# EAGLE design App_Board_V1.2 (EAGLE 7.1.0)
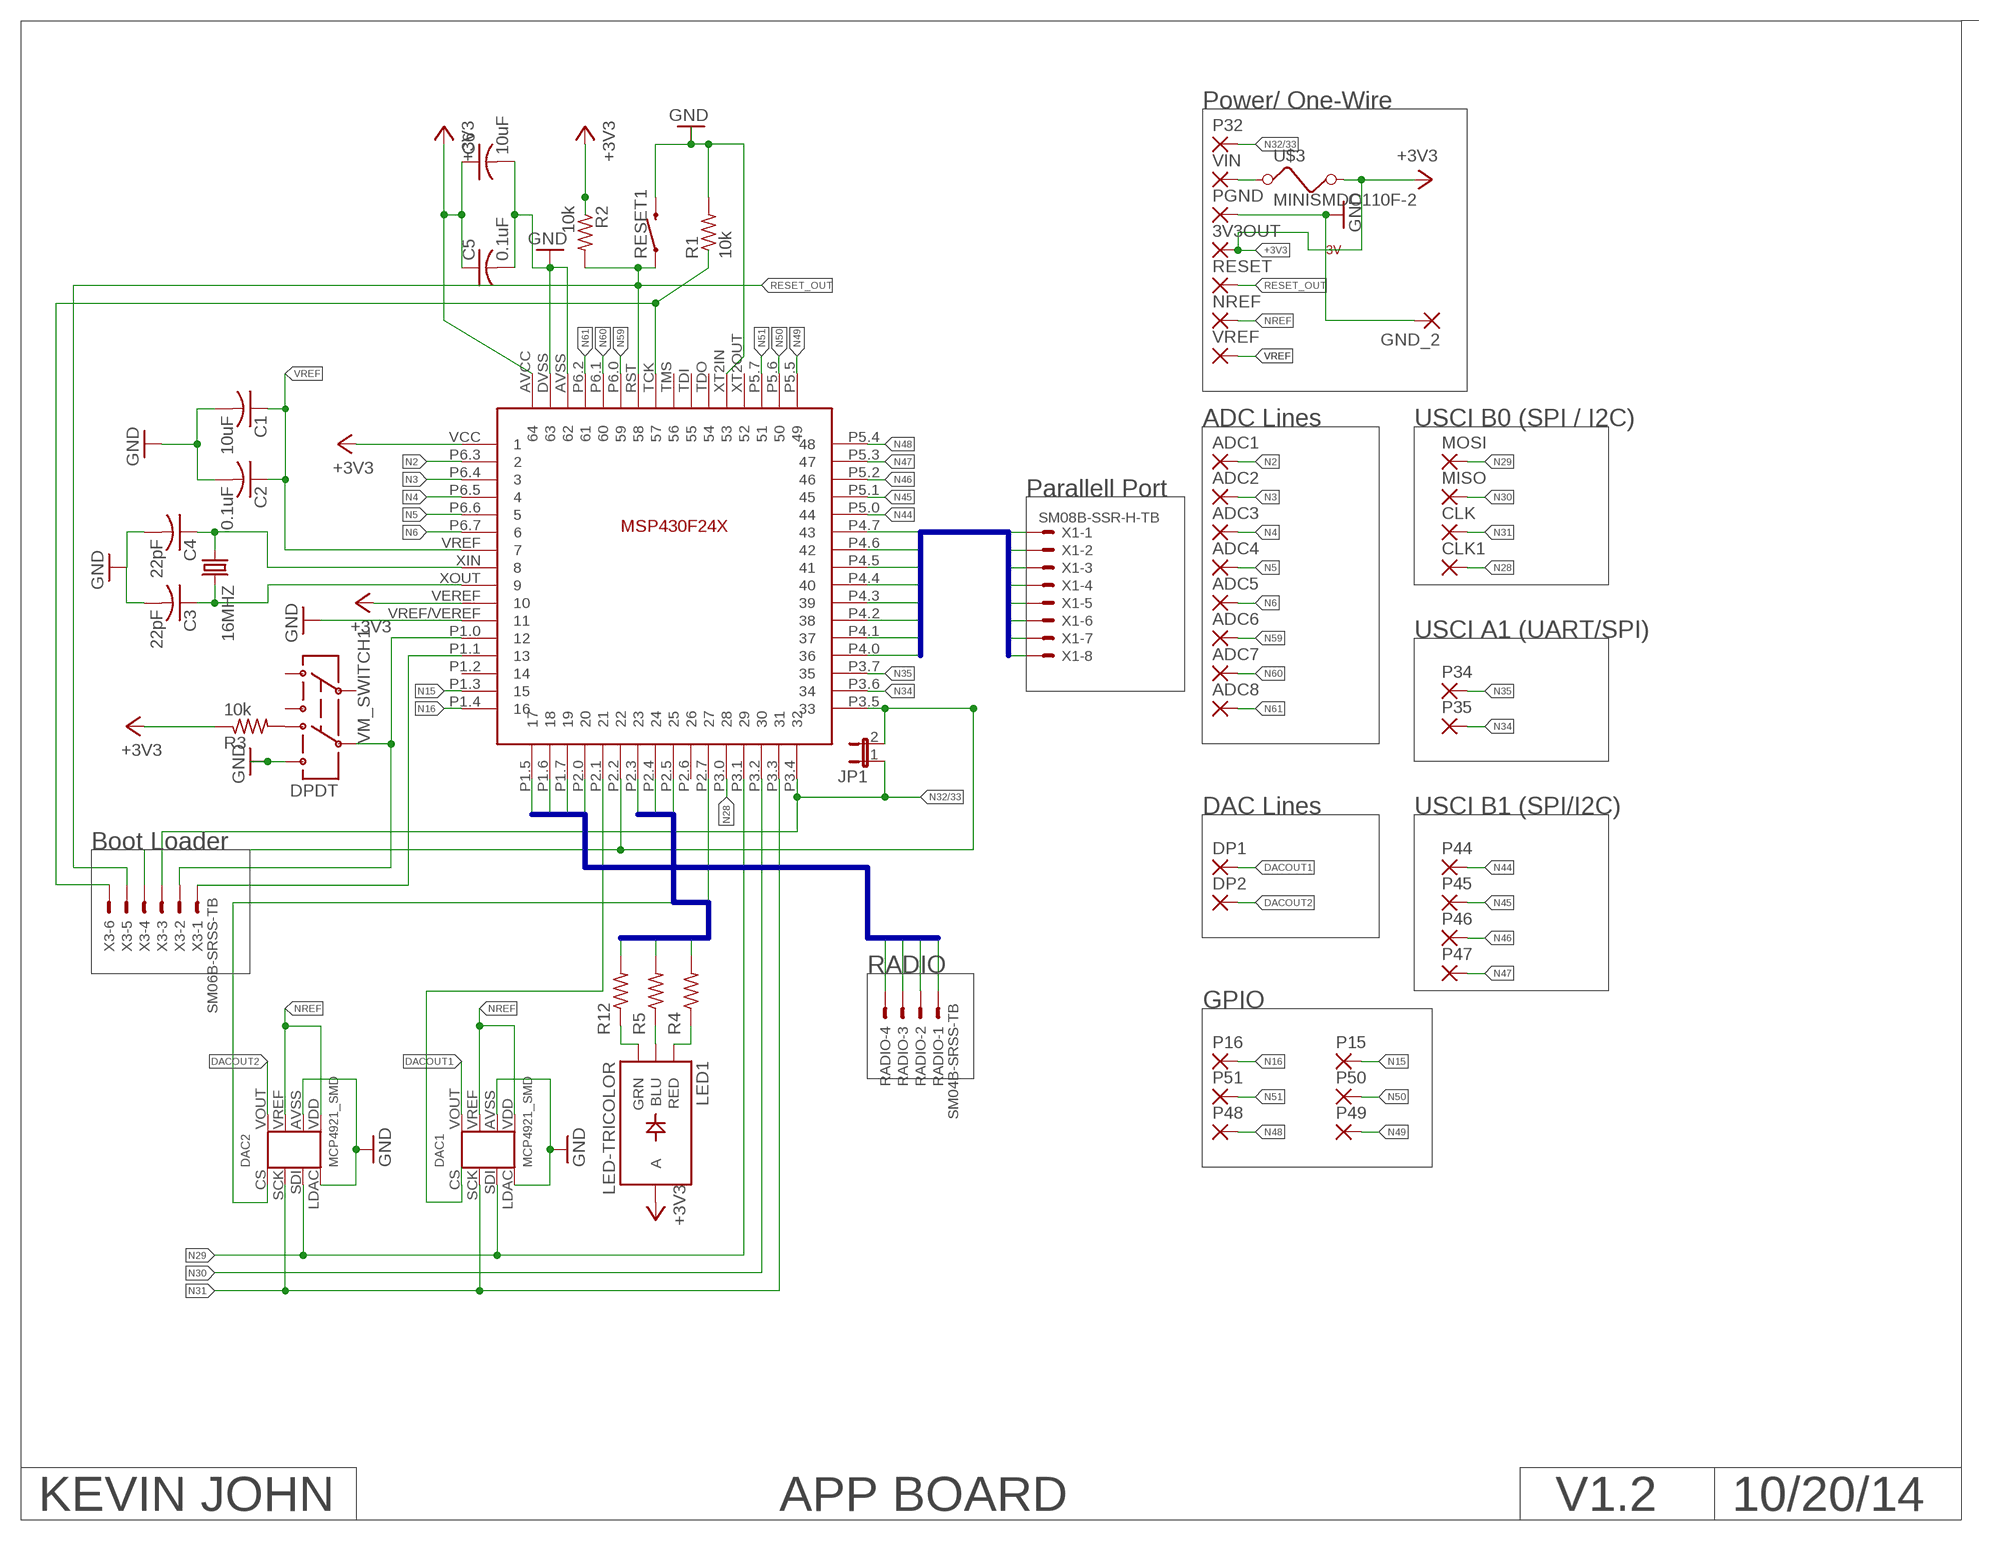
[diagram p0: schematic, sheet 1]

## Parts
3V3OUT  1,6/0,9  [1,6/0,9]
16MHZ  CRYSTAL5X3  [CRYSTAL-SMD-5X3]
ADC1  1,6/0,9  [1,6/0,9]
ADC2  1,6/0,9  [1,6/0,9]
ADC3  1,6/0,9  [1,6/0,9]
ADC4  1,6/0,9  [1,6/0,9]
ADC5  1,6/0,9  [1,6/0,9]
ADC6  1,6/0,9  [1,6/0,9]
ADC7  1,6/0,9  [1,6/0,9]
ADC8  1,6/0,9  [1,6/0,9]
C1  10uF  C-USC0805  [C0805]
C2  0.1uF  C-USC0805  [C0805]
C3  22pF  C-USC0805  [C0805]
C4  22pF  C-USC0805  [C0805]
C5  0.1uF  C-USC0805  [C0805]
C6  10uF  C-USC1210  [C1210]
CLK  1,6/0,9  [1,6/0,9]
CLK1  1,6/0,9  [1,6/0,9]
DAC1  MCP4921_SMD  [MCP4921_SMD]
DAC2  MCP4921_SMD  [MCP4921_SMD]
DP1  1,6/0,9  [1,6/0,9]
DP2  1,6/0,9  [1,6/0,9]
GND_2  1,6/0,9  [1,6/0,9]
JP1  JP1E  [JP1]
LED1  LED-TRICOLOR  [LED-TRICOLOR-SMD]
MISO  1,6/0,9  [1,6/0,9]
MOSI  1,6/0,9  [1,6/0,9]
NREF  1,6/0,9  [1,6/0,9]
P15  1,6/0,9  [1,6/0,9]
P16  1,6/0,9  [1,6/0,9]
P32  1,6/0,9  [1,6/0,9]
P34  1,6/0,9  [1,6/0,9]
P35  1,6/0,9  [1,6/0,9]
P44  1,6/0,9  [1,6/0,9]
P45  1,6/0,9  [1,6/0,9]
P46  1,6/0,9  [1,6/0,9]
P47  1,6/0,9  [1,6/0,9]
P48  1,6/0,9  [1,6/0,9]
P49  1,6/0,9  [1,6/0,9]
P50  1,6/0,9  [1,6/0,9]
P51  1,6/0,9  [1,6/0,9]
PGND  1,6/0,9  [1,6/0,9]
R1  10k  R-US_R0603  [R0603]
R2  10k  R-US_R0603  [R0603]
R3  10k  R-US_R0603  [R0603]
R4  100  R-US_R0603  [R0603]
R5  100  R-US_R0603  [R0603]
R12  100  R-US_R0603  [R0603]
RADIO  SM04B-SRSS-TB  [SM04B-SRSS-TB]
RESET  1,6/0,9  [1,6/0,9]
RESET1  SWITCH-MOMENTARY-2SMD  [TACTILE_SWITCH_SMD]
U$1  MSP430  [MSP430]
U$3  MINISMDC110F-2  [MINISMDC110]
VIN  1,6/0,9  [1,6/0,9]
VM_SWITCH1  DPDT  SWITCH-DPDTAYZ0202  [AYZ0202]
VREF  1,6/0,9  [1,6/0,9]
X1  SM08B-SSR-H-TB  [SM08B-SSR-H-TB]
X3  SM06B-SRSS-TB  [SM06B-SRSS-TB]

## Nets
3.3VOUT: U$3.P$1 VIN.1(P)
+3V3: 3V3OUT.1(P) C5.1 C6.1 LED1.A R2.1 R3.1 U$1.AVCC U$1.VCC U$1.VEREF U$3.P$2
DACOUT1: DAC1.VOUT DP1.1(P)
DACOUT2: DAC2.VOUT DP2.1(P)
GND [Standard]: C1.2 C2.2 C3.2 C4.2 C5.2 C6.2 DAC1.AVSS(VCC) DAC1.LDAC(LADC) DAC2.AVSS(VCC) DAC2.LDAC(LADC) GND_2.1(P) PGND.1(P) R1.2 RESET1.3 U$1.AVSS U$1.DVSS U$1.VREF/VEREF U$1.XT2IN VM_SWITCH1.6
LED0: R5.2 U$1.P2.3
LED1: R12.2 U$1.P2.4
LED2: R4.2 U$1.P2.5
N2: ADC1.1(P) U$1.P6.3
N3: ADC2.1(P) U$1.P6.4
N4: ADC3.1(P) U$1.P6.5
N5: ADC4.1(P) U$1.P6.6
N6: ADC5.1(P) U$1.P6.7
N15: P15.1(P) U$1.P1.3
N16: P16.1(P) U$1.P1.4
N20: DAC2.CS U$1.P2.7
N28: CLK1.1(P) U$1.P3.0
N29: DAC1.SDI DAC2.SDI MOSI.1(P) U$1.P3.1
N30: MISO.1(P) U$1.P3.2
N31: CLK.1(P) DAC1.SCK DAC2.SCK U$1.P3.3
N32: JP1.2 U$1.P2.2 U$1.P3.5 X3.4
N32/33: JP1.1 P32.1(P) U$1.P3.4 X3.3
N34: P35.1(P) U$1.P3.6
N35: P34.1(P) U$1.P3.7
N44: P44.1(P) U$1.P5.0
N45: P45.1(P) U$1.P5.1
N46: P46.1(P) U$1.P5.2
N47: P47.1(P) U$1.P5.3
N48: P48.1(P) U$1.P5.4
N49: P49.1(P) U$1.P5.5
N50: P50.1(P) U$1.P5.6
N51: P51.1(P) U$1.P5.7
N59: ADC6.1(P) U$1.P6.0
N60: ADC7.1(P) U$1.P6.1
N61: ADC8.1(P) U$1.P6.2
N$3: 16MHZ.1 C4.1 U$1.XIN
N$5: R3.2 VM_SWITCH1.4
N$6: LED1.G(GRN) R12.1
N$7: LED1.B(BLU) R5.1
N$8: LED1.R(RED) R4.1
N$12: U$1.P1.0 VM_SWITCH1.5 X3.2
N$13: DAC1.CS U$1.P2.1
N$14: 16MHZ.3 C3.1 U$1.XOUT
N$15: U$1.P1.1 X3.1
NREF: DAC1.VDD DAC1.VREF DAC2.VDD DAC2.VREF NREF.1(P)
RADIO_IRQ: RADIO.3 U$1.P1.6
RADIO_RX: RADIO.2 U$1.P1.7
RADIO_SELECT: RADIO.4 U$1.P1.5
RADIO_TX: RADIO.1 U$1.P2.0
RESET_OUT: R2.2 RESET1.1 RESET.1(P) U$1.RST X3.5
RTS1: R1.1 U$1.TCK X3.6
SERIAL0: U$1.P4.7 X1.1
SERIAL1: U$1.P4.6 X1.2
SERIAL2: U$1.P4.5 X1.3
SERIAL3: U$1.P4.4 X1.4
SERIAL4: U$1.P4.3 X1.5
SERIAL5: U$1.P4.2 X1.6
SERIAL6: U$1.P4.1 X1.7
SERIAL7: U$1.P4.0 X1.8
VREF [Standard]: C1.1 C2.1 U$1.VREF VREF.1(P)
Unconnected: U$1.P1.2 U$1.P2.6 U$1.TDI U$1.TDO U$1.TMS U$1.XT2OUT VM_SWITCH1.1 VM_SWITCH1.2 VM_SWITCH1.3

## Buses
SERIAL[0..7]
RADIO[0..3]
LED[0..2]

## Notes on the sheet
- Power/ One-Wire
- 3V
- ADC Lines | USCI B0 (SPI / I2C)
- Parallell Port
- USCI A1 (UART/SPI)
- DAC Lines | USCI B1 (SPI/I2C)
- Boot Loader
- RADIO
- GPIO
- KEVIN JOHN | APP BOARD | V1.2 | 10/20/14

## Library data of the parts
3V3OUT ADC1-ADC8 CLK CLK1 DP1 DP2 GND_2 MISO MOSI NREF P15 P16 P32 P34 P35 P44-P51 PGND RESET VIN VREF = wirepad:1,6/0,9: THROUGH-HOLE PAD
16MHZ = SparkFun-FreqCtrl:CRYSTAL: Various standard crystals. Proven footprints. Spark Fun Electronics SKU : COM-00534
C1-C6 = rcl:C-US: CAPACITOR, American symbol
DAC1 DAC2 = PocketCube:MCP4921_SMD
JP1 = jumper:JP1E: JUMPER
LED1 = SparkFun-LED:LED-TRICOLOR: Tri-Color LED SMD Proven layout and schematic for triple color LED in SMD package - common anode. Spark Fun Electronics SKU : COM-07844
R1-R5 R12 = rcl:R-US_: RESISTOR, American symbol
RADIO = con-jst2:?M04B-SRSS-TB: Disconnectable Crimp style connector, 1.0mm pitch 4 contacts
RESET1 = SparkFun-Electromechanical:SWITCH-MOMENTARY-2: Various NO switches- pushbuttons, reed, etc
U$1 = LearningByMaking:MSP430
U$3 = LearningByMaking:MINISMDC110F-2
VM_SWITCH1 = SparkFun-Electromechanical:SWITCH-DPDT: DPDT Version of the COM-00597; PROD_ID: SWCH-08179
X1 = con-jst2:SM08B-SSR-H-TB: Disconnectable Insulation displacement connector, 1.0mm pitch 8 contacts
X3 = con-jst2:?M06B-SRSS-TB: Disconnectable Crimp style connector, 1.0mm pitch 6 contacts

## Net classes
1 Standard: width 0.152 mm, drill 0.152 mm, clearance 0.152 mm

## Board
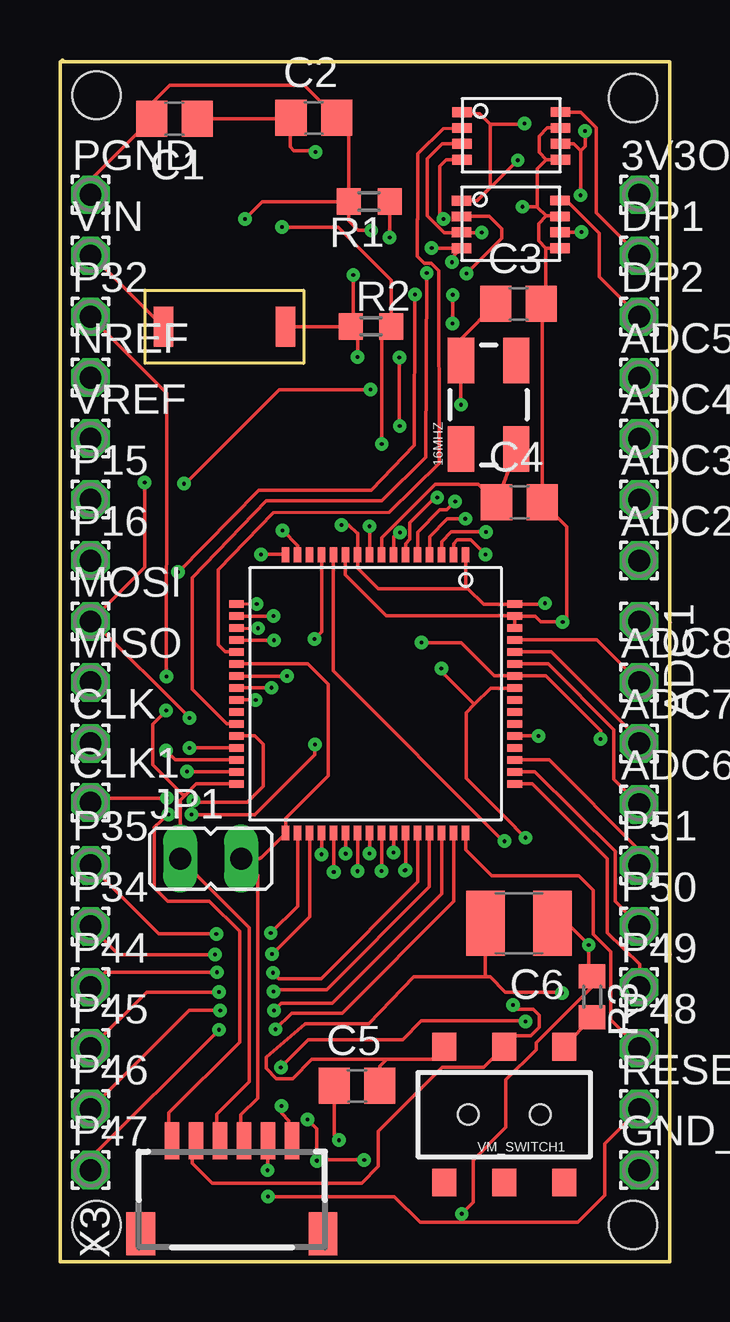
[diagram p1: board, top side]
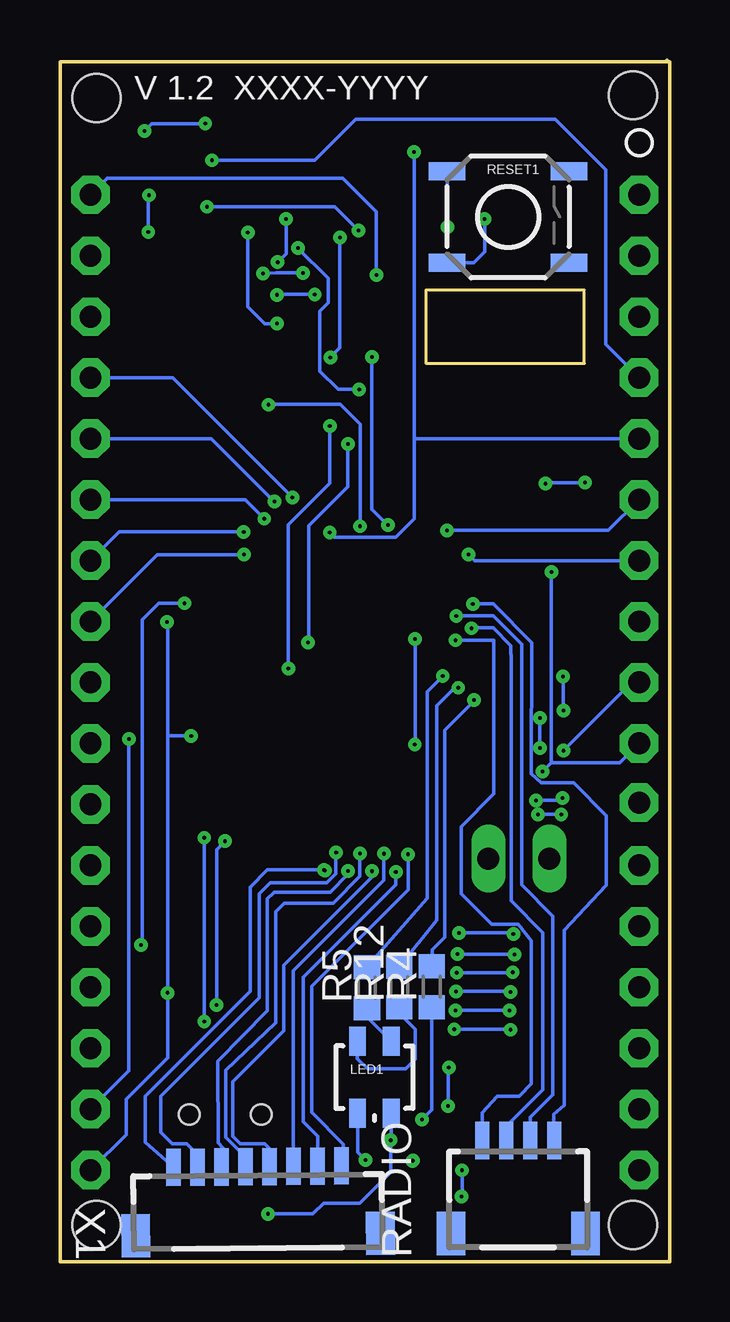
[diagram p2: board, bottom side, seen from below]

Size 25.4 x 50.07 mm. Coordinates in mm from the lower left corner, seen from the top.
Outline: 0.1,50.07 0.11,50.07
Outline: 0,0 25.4,0 25.4,50 0,50 0,0
Copper layers (1*16): Top 0.035mm / dielectric 1.5mm / Bottom 0.035mm
Design rules "default": minimum track width 10mil, minimum drill 24mil, track to track 8mil, track to pad 8mil, pad to pad 8mil, via to via 8mil, smd to smd 8mil, copper to edge 40mil, drill to drill 8mil, minimum pad ring 10mil, minimum via ring 8mil, stop-mask expansion 4mil, vias tented up to drill 0mil, thermal gap 10mil
Holes 2 mm at 1.52,48.6 23.88,48.48 1.52,1.52 23.88,1.52

### Footprints (pad centres in the part's own frame; a part is rotated, then mirrored left to right if it is on the bottom)
1,6/0,9 = drill 0.914 pad 1.6 octagon: 1 0,0
CRYSTAL-SMD-5X3 = smd 1.9 x 1.1: 1 -1.85,-1.15; 2 1.85,-1.15; 3 1.85,1.15; 4 -1.85,1.15
C0805 = smd 1.3 x 1.5: 1 -0.95,0; 2 0.95,0
C1210 = smd 1.6 x 2.7: 1 -1.4,0; 2 1.4,0
MCP4921_SMD = smd 0.813 x 0.406: AVSS 4.504,1.323; CS 0.414,1.322; LDAC 4.504,0.002; SCK 0.414,0.661; SDI 0.414,0.001; VDD 0.414,1.982; VOUT 4.504,1.983; VREF 4.504,0.662
JP1 = drill 0.914 long: 1 0,-1.27; 2 0,1.27
LED-TRICOLOR-SMD = smd 0.7 x 1.2: A 0.7,-1.5; B 0.7,1.5; G -0.7,1.5; R -0.7,-1.5
R0603 = smd 1 x 1.1: 1 -0.85,0; 2 0.85,0
SM04B-SRSS-TB = smd 0.6 x 1.55: 1 -1.5,2.975; 2 -0.5,2.975; 3 0.5,2.975; 4 1.5,2.975 | smd 1.2 x 1.8: FIT@1 -2.8,-0.9; FIT@2 2.8,-0.9
TACTILE_SWITCH_SMD = smd 1.524 x 0.762: 1 -2.54,1.905; 2 2.54,1.905; 3 -2.54,-1.905; 4 2.54,-1.905
MSP430 = smd 0.305 x 0.61: AVCC -3.81,5.5; AVSS -2.81,5.5; DVSS -3.31,5.5; P1.5 -3.81,-6.1; P1.6 -3.31,-6.1; P1.7 -2.81,-6.1; P2.0 -2.31,-6.1; P2.1 -1.81,-6.1; P2.2 -1.31,-6.1; P2.3 -0.81,-6.1; P2.4 -0.31,-6.1; P2.5 0.19,-6.1; P2.6 0.69,-6.1; P2.7 1.19,-6.1; P3.0 1.69,-6.1; P3.1 2.19,-6.1; P3.2 2.69,-6.1; P3.3 3.19,-6.1; P3.4 3.69,-6.1; P5.5 3.69,5.5; P5.6 3.19,5.5; P5.7 2.69,5.5; P6.0 -1.31,5.5; P6.1 -1.81,5.5; P6.2 -2.31,5.5; RST -0.81,5.5; TCK -0.31,5.5; TDI 0.69,5.5; TDO 1.19,5.5; TMS 0.19,5.5; XT2IN 1.69,5.5; XT2OUT 2.19,5.5 | smd 0.61 x 0.305: P1.0 -5.86,-2.05; P1.1 -5.86,-2.55; P1.2 -5.86,-3.05; P1.3 -5.86,-3.55; P1.4 -5.86,-4.05; P3.5 5.74,-4.05; P3.6 5.74,-3.55; P3.7 5.74,-3.05; P4.0 5.74,-2.55; P4.1 5.74,-2.05; P4.2 5.74,-1.55; P4.3 5.74,-1.05; P4.4 5.74,-0.55; P4.5 5.74,-0.05; P4.6 5.74,0.45; P4.7 5.74,0.95; P5.0 5.74,1.45; P5.1 5.74,1.95; P5.2 5.74,2.45; P5.3 5.74,2.95; P5.4 5.74,3.45; P6.3 -5.86,2.95; P6.4 -5.86,2.45; P6.5 -5.86,1.95; P6.6 -5.86,1.45; P6.7 -5.86,0.95; VCC -5.86,3.45; VEREF -5.86,-1.05; VREF -5.86,0.45; VREF/VEREF -5.86,-1.55; XIN -5.86,-0.05; XOUT -5.86,-0.55
MINISMDC110 = smd 0.813 x 1.676: P$1 -2.54,0; P$2 2.54,0
AYZ0202 = smd 1 x 1.15: 1 -2.5,2.825; 2 0,2.825; 3 2.5,2.825; 4 -2.5,-2.825; 5 0,-2.825; 6 2.5,-2.825 | hole 0.85: 1.5,0; -1.5,0
SM08B-SSR-H-TB = smd 0.6 x 1.55: 1 -3.5,1.925; 2 -2.5,1.925; 3 -1.5,1.925; 4 -0.5,1.925; 5 0.5,1.925; 6 1.5,1.925; 7 2.5,1.925; 8 3.5,1.925 | smd 1.2 x 1.8: FIT@1 -5.1,-0.9; FIT@2 5.1,-0.9
SM06B-SRSS-TB = smd 0.6 x 1.55: 1 -2.5,2.975; 2 -1.5,2.975; 3 -0.5,2.975; 4 0.5,2.975; 5 1.5,2.975; 6 2.5,2.975 | smd 1.2 x 1.8: FIT@1 -3.8,-0.9; FIT@2 3.8,-0.9

### Placement (x,y rotation side)
3V3OUT  24.13,44.45 0 top
16MHZ  17.86,35.7 90 top
ADC1  24.13,26.67 270 top
ADC2  24.13,29.21 0 top
ADC3  24.13,31.75 0 top
ADC4  24.13,34.29 0 top
ADC5  24.13,36.83 0 top
ADC6  24.13,19.05 0 top
ADC7  24.13,21.59 0 top
ADC8  24.13,24.13 0 top
C1  4.77,47.62 180 top
C2  10.58,47.65 0 top
C3  19.1,39.9 0 top
C4  19.14,31.64 0 top
C5  12.37,7.32 0 top
C6  19.13,14.1 180 top
CLK  1.27,21.59 0 top
CLK1  1.27,19.13 0 top
DAC1  16.34,45.91 0 top
DAC2  16.32,42.22 0 top
DP1  24.13,41.91 0 top
DP2  24.13,39.37 0 top
GND_2  24.13,3.81 0 top
JP1  6.28,16.79 270 top
LED1  12.3,7.68 0 bottom
MISO  1.27,24.13 0 top
MOSI  1.27,26.67 0 top
NREF  1.27,36.83 0 top
P15  1.27,31.75 0 top
P16  1.27,29.21 0 top
P32  1.27,39.37 0 top
P34  1.27,13.97 0 top
P35  1.27,16.51 0 top
P44  1.27,11.43 0 top
P45  1.27,8.89 0 top
P46  1.27,6.35 0 top
P47  1.27,3.81 0 top
P48  24.13,8.89 0 top
P49  24.13,11.43 0 top
P50  24.13,13.97 0 top
P51  24.13,16.51 0 top
PGND  1.27,44.45 0 top
R1  12.88,44.17 180 top
R2  12.96,38.97 0 top
R3  22.17,11.03 270 top
R4  9.91,11.46 90 bottom
R5  12.61,11.41 90 bottom
R12  11.26,11.44 90 bottom
RADIO  6.31,2.07 0 bottom
RESET  24.13,6.35 0 top
RESET1  6.73,43.53 0 bottom
U$1  13.45,23.59 270 top
U$3  6.85,38.95 0 top
VIN  1.27,41.91 0 top
VM_SWITCH1  18.51,6.13 180 top
VREF  1.27,34.29 0 top
X1  17.15,2.03 0.5 bottom
X3  7.16,2.06 0 top

### Tracks (layer width: path | path; a pad name or v marks a point on that pad's centre or on a via)
3.3VOUT
  Top 0.152: VIN.1 1.35,41.91 U$3.P$1
+3V3  (via drill 0.15, 0.15 pad 0.15)
  Top 0.152: U$3.P$2 12.09,38.95 R2.1 | R2.1 12.4,38.68 v12.4,37.69 | U$1.VCC 16.9,28.13 16.99,28.04 | 16.99,28.04 17.65,27.38 18.93,27.38 | 18.93,27.38 U$1.AVCC | 16.99,28.04 13.25,28.04 12.41,28.89 U$1.VEREF | v11.73,30.69 12.04,30.69 12.39,30.34 12.4,30.34 U$1.VEREF | R2.1 12.22,39.08 v12.22,41.11 | v16.74,1.99 17.22,2.47 17.22,4.23 18.58,5.59 18.58,7.57 19.85,8.84 19.85,9.12 22.17,11.45 R3.1 22.03,12.02 v22.03,13.2 21.13,14.1 C6.1 | 18.93,27.38 20.16,27.38 v20.21,27.43 | U$1.VEREF 12.39,29.46 | C5.1 11.42,5.26 v11.62,5.06
  Bottom 0.152: v12.4,37.69 12.4,31.35 v11.73,30.69 | v12.22,41.11 12.22,43.74 13.62,45.15 16.74,45.14 23.44,45.14 3V3OUT.1 | v16.74,1.99 14.86,1.99 14.41,2.44 12.92,2.44 11.61,3.75 11.62,3.76 v11.62,5.06 11.6,5.08 LED1.A 11.61,6.58 | v20.21,27.43 21.28,27.43 21.97,26.74 21.97,13.26 v22.03,13.2
DACOUT1
  Top 0.152: DAC1.VOUT 21.69,47.9 22.34,47.25 22.34,43.7 DP1.1
DACOUT2
  Top 0.152: DAC2.VOUT 21.11,44.21 22.46,42.85 22.46,41.04 DP2.1
GND  (via drill 0.15, 0.15 pad 0.15)
  Top 0.152: U$1.AVSS U$1.DVSS | 13.61,8.42 15.48,8.42 VM_SWITCH1.6 16.01,8.66 | 13.61,8.42 10.49,8.42 9.69,7.62 9.02,7.62 8.59,8.05 8.59,8.52 10.22,9.92 12.86,9.92 14.73,11.86 17.73,11.86 | U$1.VREF/VEREF 11.88,29.43 11.88,28.61 13.59,26.9 U$1.DVSS | v20.92,11.2 20.89,11.22 18.56,11.22 17.93,11.86 17.73,11.86 | U$1.DVSS 19.79,26.89 20.03,26.66 v20.95,26.66 21.12,26.83 21.12,30.61 C4.2 20.09,39.86 C3.2 20.25,40.09 20.25,42.23 | R1.2 12.03,47.15 C2.2 10.17,49.01 4.56,49.01 3.82,48.27 C1.2 1.27,45.06 PGND.1 | R1.2 8.44,44.17 v7.71,43.45 | DAC2.LDAC 20.25,42.23 | 20.25,42.23 19.95,42.52 19.95,43.25 20.27,43.57 | 20.27,43.57 20.89,43.57 DAC2.AVSS | DAC1.LDAC 20.27,45.91 | 20.27,45.91 19.89,45.54 19.89,43.95 | 20.27,43.57 19.89,43.94 19.89,43.95 | DAC1.AVSS 20.31,47.23 19.96,46.89 19.96,46.22 20.27,45.91 | v12.97,42.96 12.44,42.96 12.04,43.37 R1.2 | v19.27,43.95 19.89,43.95 | C5.2 13.32,8.13 13.61,8.42 | C6.2 17.73,11.86 | U$1.XT2IN v19.93,21.9
  Bottom 0.152: 20.91,21.91 v20.92,11.2 20.92,8.49 22.65,6.76 22.65,5.29 GND_2.1 | 20.91,21.91 20.92,26.63 v20.95,26.66 | v7.71,43.45 7.71,42.08 8.17,41.62 RESET1.3 | v19.27,43.95 13.96,43.95 v12.97,42.96 | v19.93,21.9 20.91,21.91
LED0  (via drill 0.15)
  Top 0.152: U$1.P2.3 v9.45,24.4
  Bottom 0.152: v9.45,24.4 10.1,23.75 10.1,15.13 R5.2
LED1  (via drill 0.15)
  Top 0.152: U$1.P2.4 v8.81,23.91
  Bottom 0.152: v8.81,23.91 8.94,23.91 9.71,23.15 9.71,14.23 R12.2
LED2  (via drill 0.15)
  Top 0.152: U$1.P2.5 v8.15,23.4
  Bottom 0.152: v8.15,23.4 8.09,23.41 9.36,22.14 9.36,13.52 9.89,12.99 R4.2
N2  (via drill 0.15)
  Top 0.152: U$1.P6.3 16.4,29.91 16.56,30.07 17.11,30.07 v17.73,29.46 17.53,29.66
  Bottom 0.152: v17.73,29.46 21.34,29.46 ADC1.1
N3  (via drill 0.15)
  Top 0.152: U$1.P6.4 15.9,30 16.31,30.4 v17.74,30.4 v17.75,30.41
  Bottom 0.152: v17.75,30.41 22.93,30.41 ADC2.1
N4  (via drill 0.15)
  Top 0.152: U$1.P6.5 15.4,30.21 16.14,30.95 v16.89,30.95
  Bottom 0.152: v16.89,30.95 17.69,31.75 ADC3.1
N5  (via drill 0.15)
  Top 0.152: 14.9,29.66 U$1.P6.6 14.9,30.39 15.82,31.32 16.12,31.32 v16.47,31.66
  Bottom 0.152: v16.47,31.66 19.09,34.29 ADC4.1
N6  (via drill 0.15)
  Top 0.152: U$1.P6.7 14.4,29.91 14.58,30.09 14.58,30.79 15.64,31.84 v15.72,31.84
  Bottom 0.152: v15.72,31.84 20.71,36.83 ADC5.1
N15  (via drill 0.15)
  Top 0.152: U$1.P1.3 9.9,29.84 v9.27,30.46
  Bottom 0.152: v9.27,30.46 2.56,30.46 P15.1
N16  (via drill 0.15)
  Top 0.152: U$1.P1.4 9.39,29.46 v8.37,29.46
  Bottom 0.152: v8.37,29.46 8.12,29.21 P16.1
N20  (via drill 0.15)
  Top 0.152: U$1.P2.7 6.95,22.4 5.5,23.85 5.5,28.49 8.6,31.69 13.42,31.69 15.23,33.51 v15.28,41.19 | v16.94,41.17 17.14,41.37 18.41,42.63 18.41,43.03 17.89,43.55 DAC2.CS
  Bottom 0.152: v15.28,41.19 16.39,41.19 v16.94,41.17
N28  (via drill 0.15)
  Top 0.152: U$1.P3.0 8.12,21.9 8.47,21.55 8.47,19.8 7.8,19.13 5.65,19.13 v5.56,19.21 | v4.46,19.31 1.46,19.31 CLK1.1
  Bottom 0.152: v5.56,19.21 4.57,19.21 v4.46,19.31
N29  (via drill 0.15)
  Top 0.152: DAC1.SDI 16.1,45.91 15.82,45.63 15.82,43.6 v15.98,43.45 | v16.33,41.64 16.33,41.82 DAC2.SDI v15.49,42.23 | v12.93,36.34 12.92,36.32 9.13,36.32 5.22,32.41 v5.16,32.41 | U$1.P3.1 v5.4,21.4 | v5.4,22.65 1.39,26.67 MOSI.1 3.53,28.93 v3.53,32.46
  Bottom 0.152: v15.98,43.45 15.98,41.99 v16.33,41.64 | v15.49,42.23 14.22,40.97 14.22,39.95 14.57,39.6 14.57,37.11 13.8,36.34 v12.93,36.34 | v5.4,21.4 v5.4,22.65 | v5.16,32.41 5.12,32.46 v3.53,32.46
N30  (via drill 0.15)
  Top 0.152: U$1.P3.2 4.81,20.9 v4.42,21.29
  Bottom 0.152: v4.42,21.29 1.58,24.13 MISO.1
N31  (via drill 0.15)
  Top 0.152: v14.79,40.3 14.78,39.97 14.76,34.02 12.98,32.14 8.28,32.14 v4.92,28.73 | v16.36,39.09 v16.36,40.28 | DAC1.SCK 15.93,46.57 15.31,45.95 15.31,43.58 16.01,42.88 16.73,42.88 DAC2.SCK 16.75,42.87 v17.57,42.87 | U$1.P3.3 5.31,20.4 v5.3,20.42
  Bottom 0.152: v14.79,40.3 16.35,40.3 v16.36,40.28 | v17.57,42.87 17.57,39.79 16.86,39.08 16.37,39.08 v16.36,39.09 | v5.3,20.42 4.92,20.79 | 4.92,20.79 v4.92,28.73 | CLK.1 2.07,20.79 4.92,20.79
N32
  Top 0.152: U$1.P3.5 8.38,16.84 arc-45 8.28,16.79 JP1.2 8.24,16.1 8.24,6.82 7.54,6.11 7.54,5.04 X3.4 | U$1.P2.2 10.33,24.9 11.17,24.06 11.17,20.24 9.4,18.48 U$1.P3.5 | U$1.P3.5 arc-45 U$1.P3.5
N32/33  (via drill 0.15)
  Top 0.152: U$1.P3.4 5.69,19.91 5.24,19.45 | 5.24,19.45 5.01,19.23 5.01,18.17 JP1.1 7.89,13.91 7.89,7.49 6.54,6.14 6.54,5.58 6.58,5.55 6.58,5.07 X3.3 | v4.44,24.37 4.45,33.65 4.45,36.19 P32.1 | v4.42,22.96 3.86,22.39 3.86,20.71 5.11,19.45 5.24,19.45
  Bottom 0.152: v4.44,24.37 4.42,23.95 v4.42,22.96
N34  (via drill 0.15)
  Top 0.152: U$1.P3.6 9.9,14.81 v8.78,13.69 | v6.51,13.65 4.12,13.65 P35.1
  Bottom 0.152: v8.78,13.69 6.55,13.69 v6.51,13.65
N35  (via drill 0.15)
  Top 0.152: U$1.P3.7 10.4,14.37 v8.84,12.81 | v6.46,12.79 2.45,12.79 P34.1
  Bottom 0.152: v8.84,12.81 6.48,12.81 v6.46,12.79
N44  (via drill 0.15)
  Top 0.152: v8.87,12.04 9.11,11.79 10.88,11.79 14.91,15.82 U$1.P5.0 | v6.54,12.05 1.9,12.05 P44.1
  Bottom 0.152: v8.87,12.04 6.56,12.04 v6.54,12.05
N45  (via drill 0.15)
  Top 0.152: v8.9,11.26 8.98,11.33 11.11,11.33 15.39,15.62 U$1.P5.1 | v6.63,11.23 3.61,11.23 P45.1
  Bottom 0.152: v8.9,11.26 6.66,11.26 v6.63,11.23
N46  (via drill 0.15)
  Top 0.152: v8.92,10.47 9.22,10.77 11.35,10.77 15.9,15.32 U$1.P5.2 | v6.67,10.46 5.38,10.46 P46.1 | U$1.P5.2
  Bottom 0.152: v8.92,10.47 v6.68,10.47 v6.67,10.46
N47  (via drill 0.15)
  Top 0.152: v8.97,9.68 9.65,10.35 11.75,10.35 16.41,15.01 U$1.P5.3 | v6.63,9.66 1.27,4.3 P47.1
  Bottom 0.152: v8.97,9.68 6.65,9.68 v6.63,9.66
N48
  Top 0.152: P48.1 22.95,10.07 22.95,12.9 22.22,13.63 22.22,15.47 21.61,16.08 17.98,16.08 16.9,17.16 U$1.P5.4
N49
  Top 0.152: U$1.P5.5 19.69,19.9 22.8,16.78 22.8,13.7 24.16,12.4 P49.1
N50
  Top 0.152: U$1.P5.6 19.79,20.4 23.14,17.09 23.14,15.01 P50.1
N51
  Top 0.152: U$1.P5.7 20.38,20.9 24.13,17.14 P51.1
N59
  Top 0.152: U$1.P6.0 20.34,24.9 23.08,22.16 23.08,20.1 ADC6.1
N60
  Top 0.152: U$1.P6.1 20.47,25.4 24.13,21.74 ADC7.1
N61
  Top 0.152: U$1.P6.2 22.36,25.9 ADC8.1
N$3
  Top 0.152: 16MHZ.1 C4.1 17.43,32.4 15.63,32.4 13.4,30.17 U$1.XIN
N$5
  Top 0.152: VM_SWITCH1.4 R3.2
N$6
  Bottom 0.152: R12.1 11.21,10.3 10.59,9.68 10.59,8.43 11,8.03 12.57,8.03 13.01,8.46 LED1.G
N$7
  Bottom 0.152: R5.1 12.61,10.19 LED1.B
N$8  (via drill 0.15, 0.15 pad 0.15)
  Top 0.152: v10.7,4.21 v10.71,4.2 | v10.7,4.21 10.7,5.53 v10.32,5.92 | v12.68,4.24 10.73,4.24 v10.7,4.21
  Bottom 0.152: LED1.R 13,4.57 v12.68,4.24 | R4.1 9.91,6.32 v10.32,5.92
N$12  (via drill 0.15)
  Top 0.152: v18.88,10.69 19.06,10.51 19.73,10.51 19.97,10.27 19.97,9.77 19.61,9.41 18.85,9.41 18.57,9.13 VM_SWITCH1.5 17.66,8.1 15.93,8.1 13.26,5.42 13.26,3.97 12.56,3.27 6.33,3.27 5.51,4.1 5.51,5.01 X3.2 | v18.52,17.52 18.47,17.52 11.38,24.61 11.38,29.43 U$1.P1.0
  Bottom 0.152: v18.88,10.69 18.88,17.16 v18.52,17.52
N$13
  Top 0.152: U$1.P2.1 6.88,25.4 6.58,25.7 6.58,28.82 8.89,31.2 13.72,31.23 15.8,33.25 15.78,41.27 15.78,41.29 15.47,41.6 15.17,41.6 14.89,41.88 14.89,43.43 14.9,43.44 14.9,46.16 15.97,47.21 DAC1.CS
N$14  (via drill 0.15)
  Top 0.152: U$1.XOUT v12.9,30.63 v12.9,30.64 | v16.71,35.7 16MHZ.3 16.71,38.46 C3.1
  Bottom 0.152: v12.9,30.64 12.9,34.9 13.73,35.73 16.68,35.73 v16.71,35.7
N$15  (via drill 0.15)
  Top 0.152: U$1.P1.1 10.9,26.23 v10.6,25.94 | v4.52,18.63 3.93,18.11 3.93,15.58 4.48,15.02 6.21,15.02 7.48,13.76 7.48,9.14 4.54,6.2 4.54,5.04 X3.1 | v5.48,18.63 5.55,18.63 8.12,18.63 10.62,21.13 v10.62,21.54
  Bottom 0.152: v4.52,18.63 4.46,18.63 v5.48,18.63 | v10.62,21.54 10.6,21.56 v10.6,25.94
NREF  (via drill 0.15)
  Top 0.152: DAC2.VREF 21.72,42.89 v21.73,42.9 | v21.69,44.43 21.69,46.29 | 21.69,46.29 21.4,46.58 DAC1.VREF | 17.93,47.4 17.93,44.77 17.37,44.21 DAC2.VDD 17.39,44.21 v19.07,45.89 | 17.93,47.4 17.5,47.84 16.82,47.84 DAC1.VDD | 17.93,47.4 19.33,47.4 v19.35,47.42 | v21.88,47.1 21.88,46.48 21.69,46.29
  Bottom 0.152: v21.73,42.9 21.73,44.39 v21.69,44.43 | v19.35,47.42 21.57,47.42 v21.88,47.1 | v19.07,45.89 14.78,45.89 13.07,47.6 4.76,47.6 2.65,45.49 2.65,38.21 NREF.1
RADIO_IRQ  (via drill 0.15)
  Top 0.152: U$1.P1.6 v8.89,26.9
  Bottom 0.152: v8.89,26.9 U$1.P1.6 6.17,25.72 6.17,15.7 4.87,14.4 4.87,13.66 4.87,6.94 5.81,6.01 RADIO.3
RADIO_RX  (via drill 0.15)
  Top 0.152: U$1.P1.7 7.33,26.38 v8.25,26.39
  Bottom 0.152: v8.25,26.39 8.23,26.4 U$1.P1.7 6.61,25.66 6.61,25.3 6.61,25.29 6.61,15.03 5.28,13.7 | RADIO.2 6.81,5.63 5.28,7.16 5.28,13.7 | 5.28,13.7
RADIO_SELECT  (via drill 0.15)
  Top 0.152: U$1.P1.5 v8.2,27.4
  Bottom 0.152: v8.2,27.4 U$1.P1.5 5.74,25.79 5.77,20.32 5.34,19.95 4,19.95 2.64,18.59 2.64,15.68 4.39,13.8 4.39,6.51 4.82,6.13 4.82,5.06 RADIO.4
RADIO_TX  (via drill 0.15)
  Top 0.152: U$1.P2.0 v8.92,25.89
  Bottom 0.152: v8.92,25.89 7.32,25.89 7.32,19.48 8.67,18.13 8.67,15.32 7.42,14.07 6.3,14.07 5.76,13.37 5.77,7.4 6.27,6.88 7.18,6.88 7.8,6.21 RADIO.1 7.81,5.53
RESET_OUT  (via drill 0.15, 0.15 pad 0.15)
  Top 0.152: v9.25,43.1 11.59,43.1 13.81,40.88 R2.2 13.41,38.57 v13.41,34.06 | v15.06,25.79 16.71,25.79 18.09,24.41 18.94,24.41 U$1.RST 20.24,24.4 22.53,22.11 v22.53,21.77 | X3.5 8.66,3.81 v8.65,3.81 | v8.67,2.71 13.94,2.71 15.01,1.63 21.57,1.63 22.7,2.77 22.7,4.92 RESET.1
  Bottom 0.152: v9.25,43.1 RESET1.1 | v15.06,25.79 15.03,25.82 15.03,30.66 13.41,32.29 v13.41,34.06 | v8.65,3.81 8.65,2.73 v8.67,2.71 | v22.53,21.77 22.53,7.95 RESET.1
RTS1  (via drill 0.15)
  Top 0.152: 9.2,8.32 v9.2,8.09 10.35,9.25 14.28,9.25 15.06,10.03 19.36,10.03 v19.39,10 | 17.27,23.21 16.93,22.88 16.93,20.13 18.97,18.09 18.97,18.08 v19.39,17.66 | 17.27,23.21 17.95,23.9 U$1.TCK | R1.1 v13.74,42.66 | v14.14,37.67 14.14,34.84 v14.16,34.82 | v15.89,24.71 15.89,24.59 17.27,23.21 | v9.23,6.49 9.23,6.17 9.54,5.87 9.54,5.04 X3.6
  Bottom 0.152: v9.23,6.49 9.23,8.06 v9.2,8.09 | v19.39,10 v19.39,17.66 | v14.16,34.82 14.16,32.44 15.89,30.71 v15.89,24.71 | v13.74,42.66 13.74,38.07 v14.14,37.67
SERIAL0  (via drill 0.15, 0.15 pad 0.15)
  Top 0.152: U$1.P4.7 v14.4,16.32 v14.37,16.29
  Bottom 0.152: v14.4,16.32 14.71,16.32 16.77,16.32 17.48,15.61 17.47,12.96 17.48,12.95 17.48,11.26 21.84,6.9 21.84,4.96 X1.1
SERIAL1  (via drill 0.15, 0.15 pad 0.15)
  Top 0.152: U$1.P4.6 v13.9,17.05 v13.89,17.04
  Bottom 0.152: 17.1,12.99 17.1,10.99 21.2,6.89 21.2,5.39 20.72,4.91 20.13,4.91 19.59,4.38 X1.2 | 17.1,12.99 | v13.9,17.05 13.9,16.16 14.28,15.78 16.64,15.78 17.1,15.32 17.1,12.99
SERIAL2  (via drill 0.15, 0.15 pad 0.15)
  Top 0.152: U$1.P4.5 v13.4,16.28 v13.39,16.27
  Bottom 0.152: X1.3 18.59,4.73 18.81,4.95 18.82,8.35 16.77,10.45 16.76,15.11 16.47,15.4 14.14,15.4 13.4,16.14 v13.4,16.28
SERIAL3  (via drill 0.15)
  Top 0.152: U$1.P4.4 12.9,17.04 v12.9,17
  Bottom 0.152: X1.4 17.59,4.29 18.49,5.18 18.49,7.96 16.42,9.95 16.42,12.96 16.41,12.97 16.41,14.58 16.05,14.94 14.02,14.94 12.9,16.05 v12.9,17
SERIAL4  (via drill 0.15, 0.15 pad 0.15)
  Top 0.152: U$1.P4.3 v12.4,16.27 v12.39,16.26
  Bottom 0.152: X1.5 16.59,4.64 16.87,4.92 17.89,4.92 18.2,5.22 18.2,7.5 16.08,9.62 16.08,12.35 12.4,16.02 v12.4,16.27
SERIAL5  (via drill 0.15, 0.15 pad 0.15)
  Top 0.152: U$1.P4.2 v11.9,17
  Bottom 0.152: 15.7,3.82 X1.6 | 15.7,4 X1.6 | v11.9,17 11.9,15.89 15.67,12.12 X1.6
SERIAL6  (via drill 0.15, 0.15 pad 0.15)
  Top 0.152: U$1.P4.1 v11.41,16.24 v11.4,16.23
  Bottom 0.152: v11.41,16.24 11.41,15.7 15.27,11.84 15.27,5.82 14.67,5.22 X1.7
SERIAL7  (via drill 0.15)
  Top 0.152: U$1.P4.0 v10.9,16.98 v10.89,16.97
  Bottom 0.152: v10.89,16.97 10.89,15.49 14.91,11.48 14.91,6.22 13.59,4.9 13.59,3.72 X1.8
VREF  (via drill 0.15)
  Top 0.152: C1.1 9.59,47.62 | 9.59,47.62 C2.1 | U$1.VREF 13.9,30.2 14.07,30.37 v14.16,30.37 | 9.59,47.62 9.59,46.44 9.74,46.29 10.58,46.29 v10.64,46.23
  Bottom 0.152: v10.64,46.23 10.64,34.29 | v14.16,30.37 13.97,30.18 11.42,30.18 10.64,30.96 10.64,33.82 10.64,34.29 | VREF.1 10.64,34.29

### Text on the board
_bsilk: V 1.2 XXXX-YYYY
200bmp: C:/Users/Kevin/Documents/eagle/AppBoard/lbym.bmp